# EAGLE design ServoControllerCircuit (EAGLE 8.6.3)
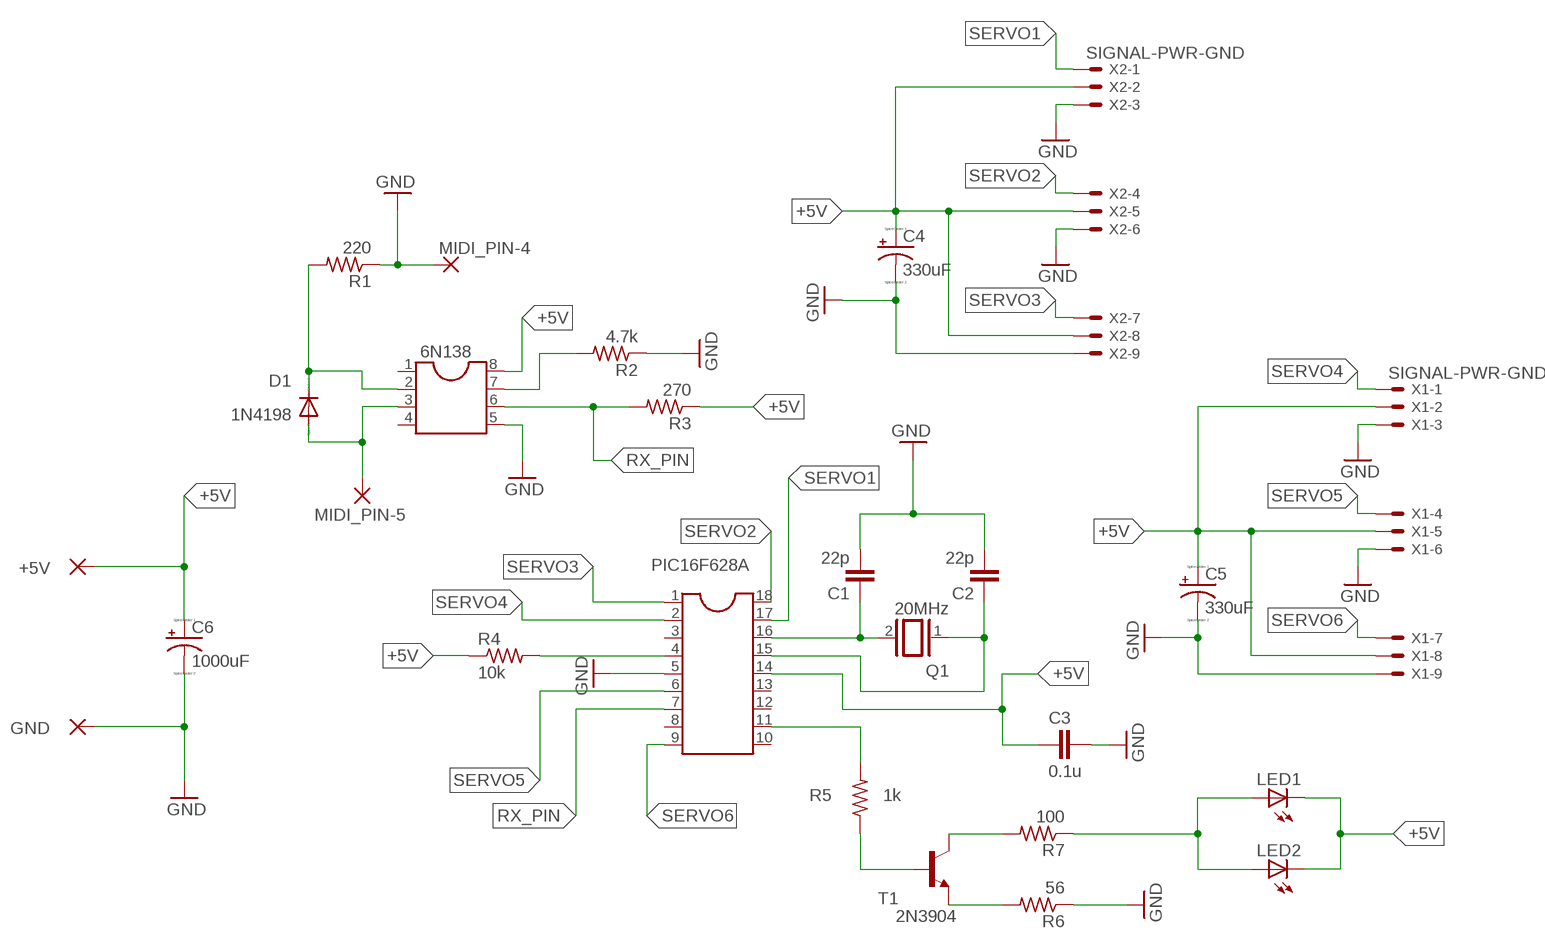
[diagram p0: schematic, sheet 1]

## Parts
6N138  DIL8S  [SOCKET-08]
+5V  2,15/1,0  [2,15/1,0]
C1  22p  C-EU050-025X075  [C050-025X075]
C2  22p  C-EU050-025X075  [C050-025X075]
C3  0.1u  C-EU050-025X075  [C050-025X075]
C4  330uF  CPOL-USE3.5-8  [E3,5-8]
C5  330uF  CPOL-USE3.5-8  [E3,5-8]
C6  1000uF  CPOL-USE5-10.5  [E5-10,5]
D1  1N4198  1N4148DO35-10  [DO35-10]
GND  2,15/1,0  [2,15/1,0]
LED1  LED5MM  [LED5MM]
LED2  LED5MM  [LED5MM]
MIDI_PIN-4  2,15/1,0  [2,15/1,0]
MIDI_PIN-5  2,15/1,0  [2,15/1,0]
PIC16F628A  DIL18S  [SOCKET-18]
Q1  20MHz  XTAL/S  [QS]
R1  220  R-US_0207/12  [0207/12]
R2  4.7k  R-US_0207/12  [0207/12]
R3  270  R-US_0207/12  [0207/12]
R4  10k  R-US_0207/12  [0207/12]
R5  1k  R-US_0207/12  [0207/12]
R6  56  R-US_0207/12  [0207/12]
R7  100  R-US_0207/12  [0207/12]
T1  2N3904  [TO92]
X1  SIGNAL-PWR-GND  22-23-2091  [22-23-2091]
X2  SIGNAL-PWR-GND  22-23-2091  [22-23-2091]

## Nets
+5V: 6N138.8 +5V.1(P) C3.2 C4.+ C5.+ C6.+ LED1.K(C) LED2.K(C) PIC16F628A.14 R3.1 R4.1 X1.2 X1.5 X1.8 X2.2 X2.5 X2.8
GND: 6N138.5 C1.2 C2.2 C3.1 C4.- C5.- C6.- GND.1(P) MIDI_PIN-4.1(P) PIC16F628A.5 R1.1 R2.1 R6.1 X1.3 X1.6 X1.9 X2.3 X2.6 X2.9
LIGHTS: PIC16F628A.11 R5.2
MIDI_PIN-5: 6N138.3 D1.A MIDI_PIN-5.1(P)
N$1: 6N138.2 D1.C R1.2
N$2: 6N138.7 R2.2
N$3: C1.1 PIC16F628A.16 Q1.2
N$4: C2.1 PIC16F628A.15 Q1.1
N$5: R5.1 T1.2(B)
N$6: PIC16F628A.4 R4.2
N$7: R6.2 T1.3(E)
N$9: R7.2 T1.1(C)
N$10: LED1.A LED2.A R7.1
RX_PIN: 6N138.6 PIC16F628A.7 R3.2
SERVO1: PIC16F628A.17 X2.1
SERVO2: PIC16F628A.18 X2.4
SERVO3: PIC16F628A.1 X2.7
SERVO4: PIC16F628A.2 X1.1
SERVO5: PIC16F628A.6 X1.4
SERVO6: PIC16F628A.9 X1.7
Unconnected: 6N138.1 6N138.4 PIC16F628A.3 PIC16F628A.8 PIC16F628A.10 PIC16F628A.12 PIC16F628A.13

## Library data of the parts
6N138 = ic-package:DIL8: Dual In Line / Socket
+5V GND MIDI_PIN-4 MIDI_PIN-5 = wirepad:2,15/1,0: THROUGH-HOLE PAD
C1-C3 = resistor:C-EU: CAPACITOR, European symbol
C4-C6 = resistor:CPOL-US: POLARIZED CAPACITOR, American symbol
D1 = diode:1N4148: DIODE high speed (Philips)
LED1 LED2 = led:LED: LED OSRAM: - CHIPLED LG R971, LG N971, LY N971, LG Q971, LY Q971, LO R971, LY R971 LH N974, LH R974 LS Q976, LO Q976, LY Q976 LO Q996 - Hyper CHIPLED LW Q18S LB Q993, LB Q99A, LB R99A - SideLED LS A670, LO A670, LY A670, LG A670, LP A670 LB A673, LV A673, LT A673, LW A673 LH A674 LY A675 LS A676, LA A676, LO A676, LY A676, LW A676 LS A679, LY A679, LG A679 - Hyper Micro SIDELED® LS Y876, LA Y876, LO Y876, LY Y876 LT Y87S - SmartLED LW L88C, LW L88S LB L89C, LB L89S, LG L890 LS L89K, LO L89K, LY L89K LS L896, LA L896, LO L896, LY L896 - TOPLED LS T670, LO T670, LY T670, LG T670, LP T670 LSG T670, LSP T670, LSY T670, LOP T670, LYG T670 LG T671, LOG T671, LSG T671 LB T673, LV T673, LT T673, LW T673 LH T674 LS T676, LA T676, LO T676, LY T676, LB T676, LH T676, LSB T676, LW T676 LB T67C, LV T67C, LT T67C, LS T67K, LO T67K, LY T67K, LW E67C LS E67B, LA E67B, LO E67B, LY E67B, LB E67C, LV E67C, LT E67C LW T67C LS T679, LY T679, LG T679 LS T770, LO T770, LY T770, LG T770, LP T770 LB T773, LV T773, LT T773, LW T773 LH T774 LS E675, LA E675, LY E675, LS T675 LS T776, LA T776, LO T776, LY T776, LB T776 LHGB T686 LT T68C, LB T68C - Hyper Mini TOPLED® LB M676 - Mini TOPLED Santana® LG M470 LS M47K, LO M47K, LY M47K Source: http://www.osram.convergy.de LUXEON: - LUMILED® LXK2-PW12-R00, LXK2-PW12-S00, LXK2-PW14-U00, LXK2-PW14-V00 LXK2-PM12-R00, LXK2-PM12-S00, LXK2-PM14-U00 LXK2-PE12-Q00, LXK2-PE12-R00, LXK2-PE12-S00, LXK2-PE14-T00, LXK2-PE14-U00 LXK2-PB12-K00, LXK2-PB12-L00, LXK2-PB12-M00, LXK2-PB14-N00, LXK2-PB14-P00, LXK2-PB14-Q00 LXK2-PR12-L00, LXK2-PR12-M00, LXK2-PR14-Q00, LXK2-PR14-R00 LXK2-PD12-Q00, LXK2-PD12-R00, LXK2-PD12-S00 LXK2-PH12-R00, LXK2-PH12-S00 LXK2-PL12-P00, LXK2-PL12-Q00, LXK2-PL12-R00 Source: www.luxeon.com KINGBRIGHT: KA-3528ASYC Source: www.kingbright.com
PIC16F628A = ic-package:DIL18: Dual In Line / Socket
Q1 = special:XTAL/S: CRYSTAL
R1-R7 = resistor:R-US_: RESISTOR, American symbol
T1 = transistor:2N3904: NPN TRANSISTOR
X1 X2 = con-molex:22-23-2091: .100" (2.54mm) Center Header - 9 Pin; MF: MOLEX; MPN: 22-23-2091; OC_FARNELL: 1756827; OC_NEWARK: 56H0450

## Board
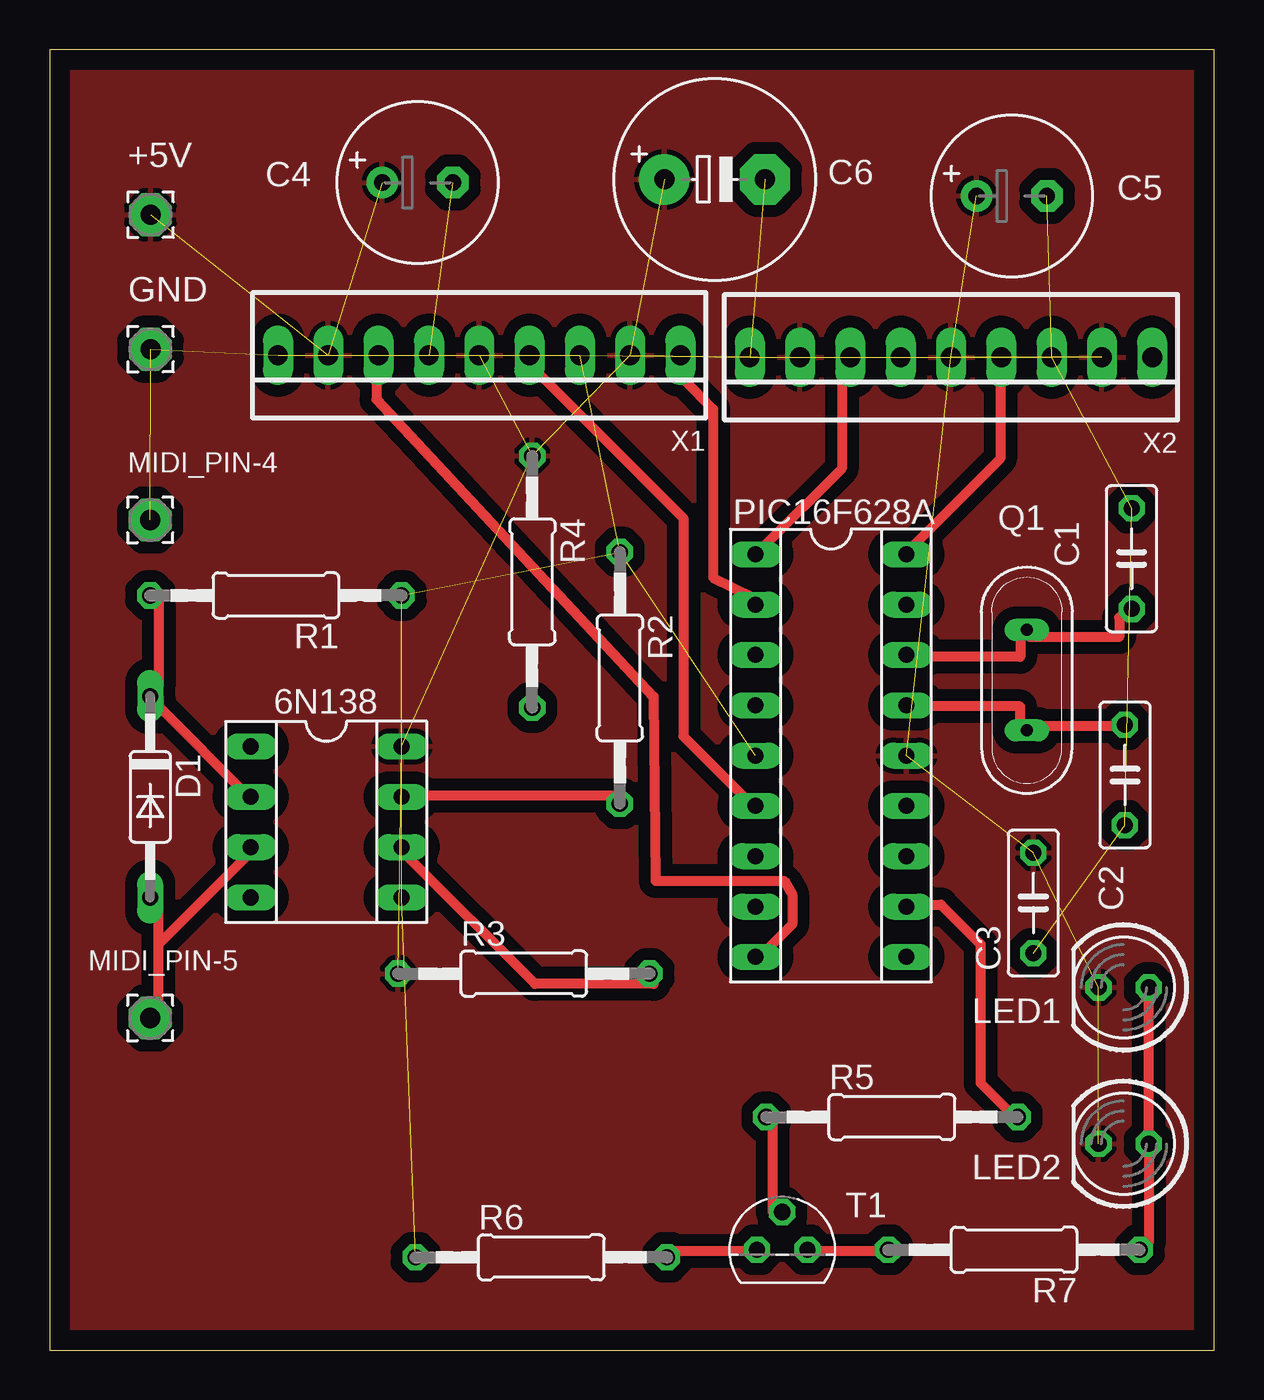
[diagram p1: board, top side]
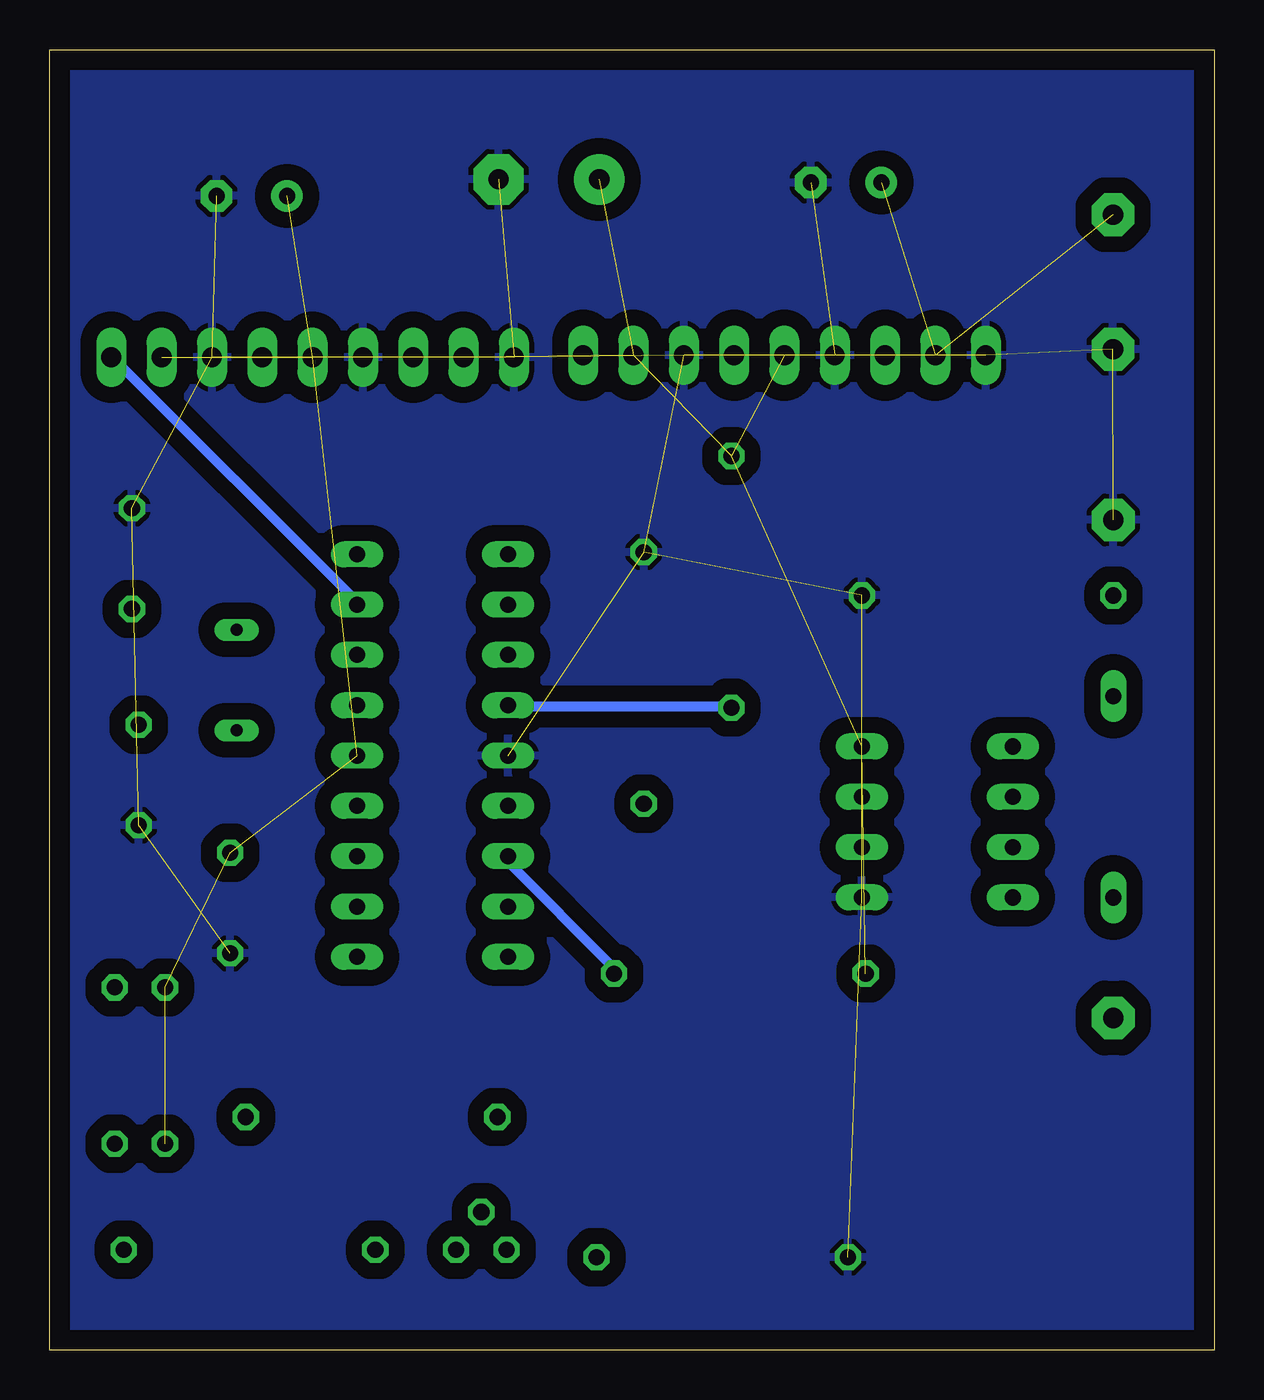
[diagram p2: board, bottom side, seen from below]

Size 58.79 x 65.65 mm. Coordinates in mm from the lower left corner, seen from the top.
Outline: 0,0 58.79,0 58.79,65.65 0,65.65 0,0
Copper layers (1*16): Top 0.035mm / dielectric 1.5mm / Bottom 0.035mm
Design rules "default": minimum track width 10mil, minimum drill 24mil, track to track 8mil, track to pad 8mil, pad to pad 8mil, via to via 8mil, smd to smd 8mil, copper to edge 40mil, drill to drill 8mil, minimum pad ring 10mil, minimum via ring 8mil, stop-mask expansion 4mil, vias tented up to drill 0mil, thermal gap 10mil

### Footprints (pad centres in the part's own frame; a part is rotated, then mirrored left to right if it is on the bottom)
SOCKET-08 = drill 0.813 long: 1 -3.81,-3.81; 2 -1.27,-3.81; 3 1.27,-3.81; 4 3.81,-3.81; 5 3.81,3.81; 6 1.27,3.81; 7 -1.27,3.81; 8 -3.81,3.81
2,15/1,0 = drill 1.016 pad 2.159 octagon: 1 0,0
C050-025X075 = drill 0.813 octagon: 1 -2.54,0; 2 2.54,0
E3,5-8 = drill 0.813 pad 1.6: + -1.778,0 | drill 0.813 pad 1.6 octagon: - 1.778,0
E5-10,5 = drill 1.016 pad 2.54: + -2.54,0 | drill 1.016 pad 2.54 octagon: - 2.54,0
DO35-10 = drill 0.813 long: A 5.08,0; C -5.08,0
LED5MM = drill 0.813 octagon: A -1.27,0; K 1.27,0
SOCKET-18 = drill 0.813 long: 1 -10.16,-3.81; 2 -7.62,-3.81; 3 -5.08,-3.81; 4 -2.54,-3.81; 5 0,-3.81; 6 2.54,-3.81; 7 5.08,-3.81; 8 7.62,-3.81; 9 10.16,-3.81; 10 10.16,3.81; 11 7.62,3.81; 12 5.08,3.81; 13 2.54,3.81; 14 0,3.81; 15 -2.54,3.81; 16 -5.08,3.81; 17 -7.62,3.81; 18 -10.16,3.81
QS = drill 0.61 long: 1 -2.54,0; 2 2.54,0
0207/12 = drill 0.813 octagon: 1 -6.35,0; 2 6.35,0
TO92 = drill 0.813 octagon: 1 1.27,0; 2 0,1.905; 3 -1.27,0
22-23-2091 = drill 1 long: 1 -10.16,0; 2 -7.62,0; 3 -5.08,0; 4 -2.54,0; 5 0,0; 6 2.54,0; 7 5.08,0; 8 7.62,0; 9 10.16,0

### Placement (x,y rotation side)
6N138  13.97,26.67 270 top
+5V  5.1,57.31 0 top
C1  54.63,39.96 90 top
C2  54.29,29.04 270 top
C3  49.67,22.58 90 top
C4  18.58,58.94 0 top
C5  48.58,58.26 0 top
C6  33.58,59.1 0 top
D1  5.08,27.94 270 top
GND  5.1,50.53 0 top
LED1  54.23,18.32 180 top
LED2  54.23,10.43 180 top
MIDI_PIN-4  5.08,41.91 0 top
MIDI_PIN-5  5.08,16.78 0 top
PIC16F628A  39.45,30.02 270 top
Q1  49.34,33.83 90 top
R1  11.43,38.1 180 top
R2  28.79,33.94 270 top
R3  23.94,19.02 0 top
R4  24.37,38.79 270 top
R5  42.53,11.78 0 top
R6  24.83,4.7 0 top
R7  48.69,5.08 180 top
T1  36.99,5.08 0 top
X1  21.69,50.22 180 top
X2  45.51,50.12 180 top

### Tracks (layer width: path | path; a pad name or v marks a point on that pad's centre or on a via)
+5V  (16 unrouted)
  pour Top (isolate 0.61): 0,0 0,66 59,66 59,0
GND  (18 unrouted)
  pour Bottom (isolate 0.813): 0,65.66 0,0 58.12,0 58.12,65.66
LIGHTS
  Top 0.5: R5.2 48.5,12 47,13.5 47,20.5 45,22.5 43.5,22.5 PIC16F628A.11
MIDI_PIN-5
  Top 0.5: 5.5,20.5 5.5,17 MIDI_PIN-5.1 | 5.5,20.5 5.5,22.5 D1.A | 5.5,20.5 10,25 6N138.3
N$1
  Top 0.5: R1.2 5.5,38 5.5,33.5 D1.C 5.5,33 5.5,32.5 10,28 6N138.2
N$2
  Top 0.5: 6N138.7 18,28 28.5,28 R2.2
N$3
  Top 0.5: C1.1 54,37 54,36 49.5,36 Q1.2 49,36 49,35 43.5,35 PIC16F628A.16
N$4
  Top 0.5: C2.1 54,31.5 49.5,31.5 Q1.1 49,31.5 49,32.5 43.5,32.5 PIC16F628A.15
N$5
  Top 0.5: T1.2 36.5,7 36.5,11.5 R5.1
N$6
  Bottom 0.5: R4.2 24.5,32.5 35.5,32.5 PIC16F628A.4
N$7
  Top 0.5: R6.2 31.5,5 35.5,5 T1.3
N$9
  Top 0.5: T1.1 38.5,5 42,5 R7.2
N$10
  Top 0.5: R7.1 55.5,5.5 LED2.A LED1.A
RX_PIN
  Top 0.5: 6N138.6 18,25 24.5,18.5 30.5,18.5 30.5,19 R3.2
  Bottom 0.5: PIC16F628A.7 35.5,24.5 30.5,19.5 R3.2
SERVO1
  Bottom 0.5: PIC16F628A.17 43.5,38 55.5,50 X2.1
SERVO2
  Top 0.5: PIC16F628A.18 43.5,40.5 48,45 48,50 X2.4
SERVO3
  Top 0.5: PIC16F628A.1 36,40.5 40,44.5 40,50 X2.7
SERVO4
  Top 0.5: PIC16F628A.2 35.5,38 33.5,39 33.5,47.5 32,49 32,50 X1.1
SERVO5
  Top 0.5: PIC16F628A.6 35.5,27.5 32,31 32,42 24.5,49.5 24.5,50 X1.4
SERVO6
  Top 0.5: PIC16F628A.9 36,20 37.5,21.5 37.5,23 37.1,23.7 30.6,23.7 30.5,33 16.5,48 16.5,50 X1.7